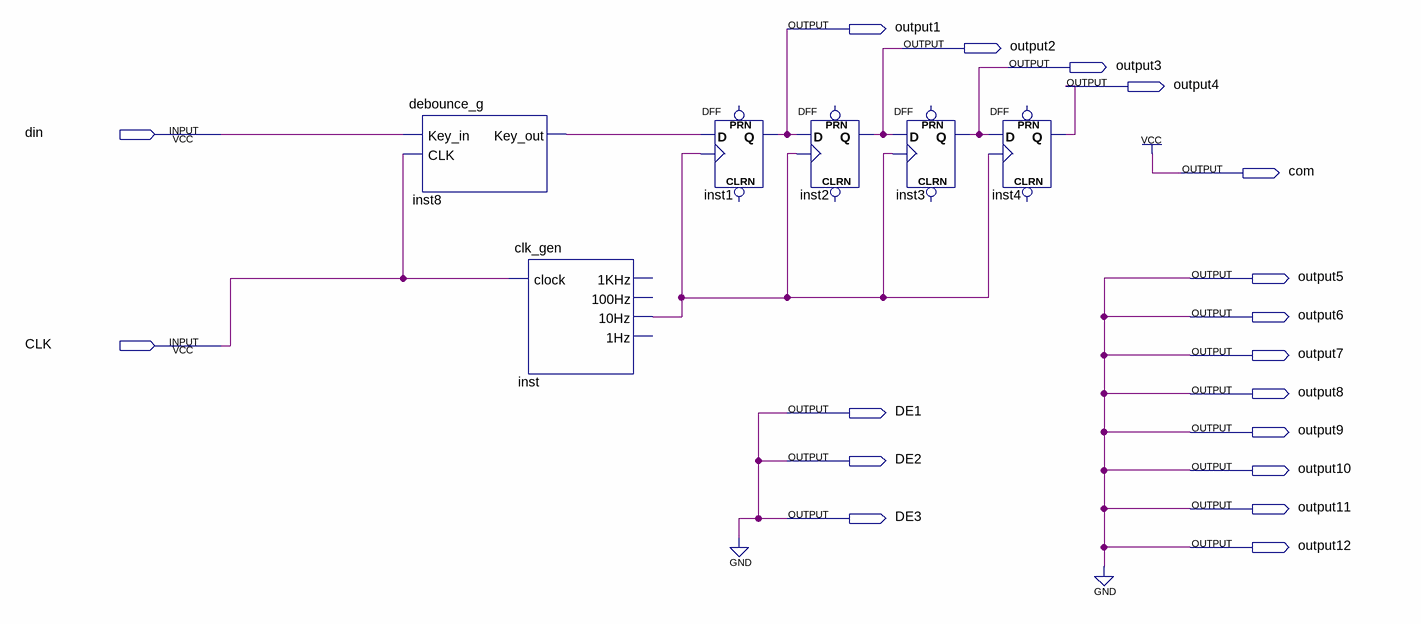
[diagram p0: schematic sheet]
// Quartus schematic component_test.bdf as structural Verilog: 6 symbols, 18 pins
module component_test (
  input  din,
  input  CLK,
  output output1,
  output output2,
  output output3,
  output output4,
  output com,
  output output5,
  output output6,
  output output7,
  output output8,
  output DE1,
  output output9,
  output DE2,
  output output10,
  output output11,
  output DE3,
  output output12
);

  wire inst8_key_out, inst_10hz;

  debounce_g inst8 (.Key_in(din), .CLK(CLK), .Key_out(inst8_key_out));
  clk_gen inst (.clock(CLK), .\10Hz (inst_10hz));  // open: 1KHz, 100Hz, 1Hz
  DFF inst1 (.CLK(inst_10hz), .D(inst8_key_out), .Q(output1));  // open: CLRN, PRN
  DFF inst2 (.CLK(inst_10hz), .D(output1), .Q(output2));  // open: CLRN, PRN
  DFF inst3 (.CLK(inst_10hz), .D(output2), .Q(output3));  // open: CLRN, PRN
  DFF inst4 (.CLK(inst_10hz), .D(output3), .Q(output4));  // open: CLRN, PRN

  assign com = 1'b1;
  assign DE1 = 1'b0;
  assign DE2 = 1'b0;
  assign DE3 = 1'b0;
  assign output5 = 1'b0;
  assign output6 = 1'b0;
  assign output7 = 1'b0;
  assign output8 = 1'b0;
  assign output9 = 1'b0;
  assign output10 = 1'b0;
  assign output11 = 1'b0;
  assign output12 = 1'b0;
endmodule
